# Altium schematic sheet wifi.SchDoc
size A
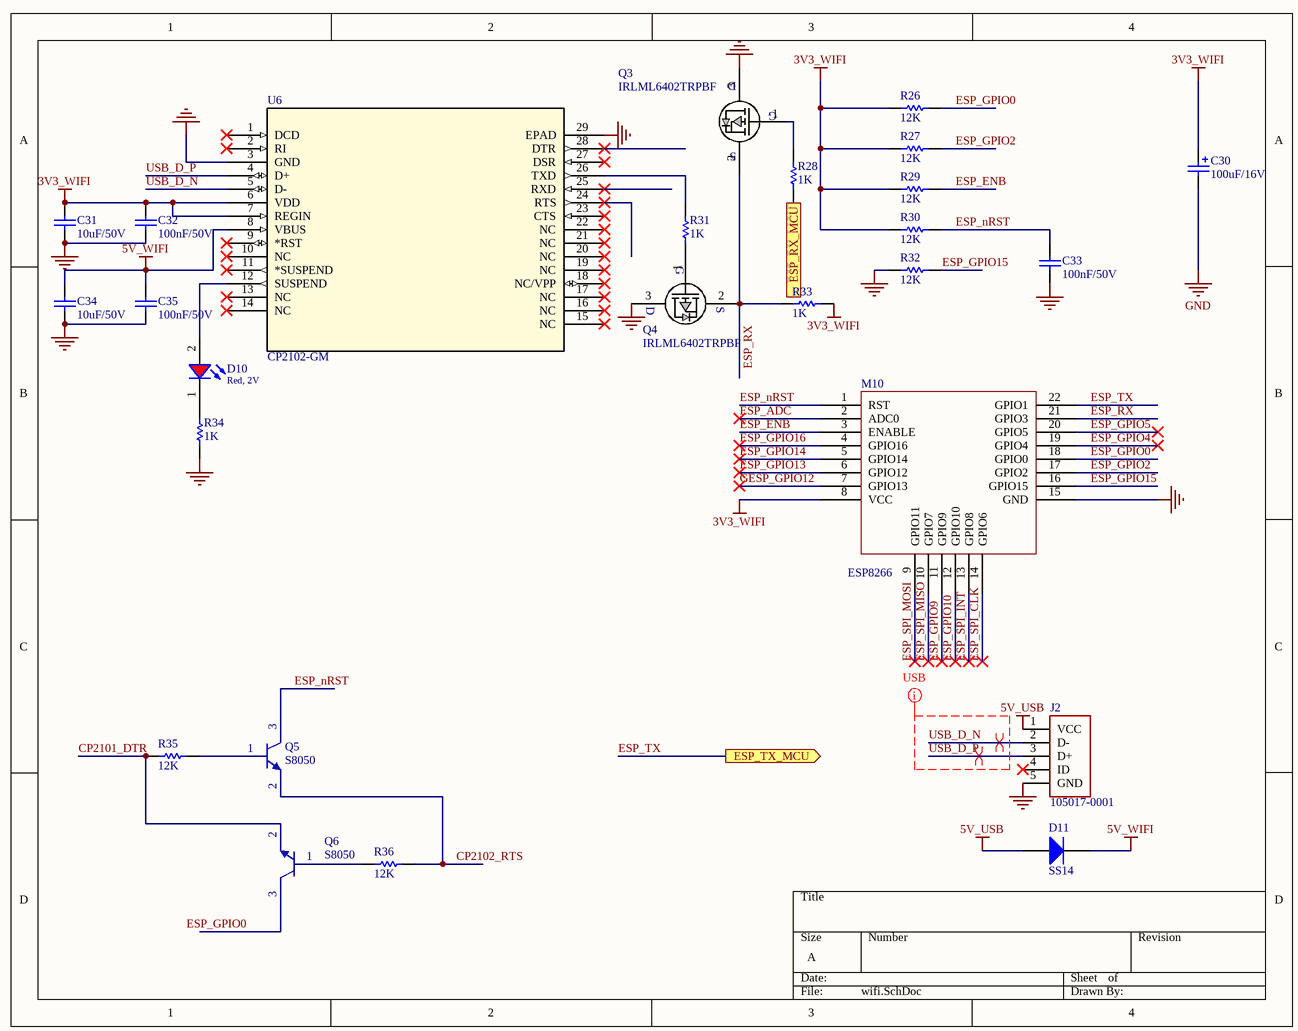
[diagram p0: wifi.SchDoc]

## Parts
C30  value 100uF/16V  [CAP_SM_TAN]  (hidden comment: TAJB107M006RNJ)
C31  value 10uF/50V  [CAP-SM-0805]  (hidden comment: Cap-10uF-50V-0805)
C32  value 100nF/50V  [CAP-SM-0805]  (hidden comment: Cap-100nF-50V-0805)
C33  value 100nF/50V  [CAP-SM-0805]  (hidden comment: Cap-100nF-50V-0805)
C34  value 10uF/50V  [CAP-SM-0805]  (hidden comment: Cap-10uF-50V-0805)
C35  value 100nF/50V  [CAP-SM-0805]  (hidden comment: Cap-100nF-50V-0805)
D10  Red, 2V  [WL-SMCW_0805]
D11  SS14  [SS14]
J2  105017-0001  [CONN_105017-0001]
M10  ESP8266  [ESP8266]
Q3  IRLML6402TRPBF  [SOT23_NEX]
Q4  IRLML6402TRPBF  [SOT23_NEX]
Q5  S8050  [SOT23_NEX]
Q6  S8050  [SOT23_NEX]
R26  value 12K  [RES-SM-0805]  (hidden comment: Res-12K-0805)
R27  value 12K  [RES-SM-0805]  (hidden comment: Res-12K-0805)
R28  value 1K  [RES-SM-0805]  (hidden comment: Res-1K-0805)
R29  value 12K  [RES-SM-0805]  (hidden comment: Res-12K-0805)
R30  value 12K  [RES-SM-0805]  (hidden comment: Res-12K-0805)
R31  value 1K  [RES-SM-0805]  (hidden comment: Res-1K-0805)
R32  value 12K  [RES-SM-0805]  (hidden comment: Res-12K-0805)
R33  value 1K  [RES-SM-0805]  (hidden comment: Res-1K-0805)
R34  value 1K  [RES-SM-0805]  (hidden comment: Res-1K-0805)
R35  value 12K  [RES-SM-0805]  (hidden comment: Res-12K-0805)
R36  value 12K  [RES-SM-0805]  (hidden comment: Res-12K-0805)
U6  CP2102-GM  [CP2102-GM]

## Ports
ESP_RX_MCU (in), ESP_TX_MCU (out)

## Nets
3V3_WIFI: C30.1 C31.2 C32.2 M10.8(VCC) R26.1 R27.1 R29.1 R30.1 R33.2 U6.6(VDD) U6.7(REGIN)
5V_USB: D11.2(A) J2.1(VCC)
5V_WIFI: C34.2 C35.1 D11.1(K) U6.8(VBUS)
GND: C30.2 C31.1 C32.1 C33.1 C34.1 C35.2 J2.5(GND) M10.15(GND) Q3.3(D) Q4.3(D) R32.1 R34.1 U6.3(GND) U6.29(EPAD)
CP2101_DTR: Q6.2(E) R35.1
CP2102_RTS: Q5.2(E) R36.2
ESP_ADC: M10.2(ADC0)
ESP_ENB: M10.3(ENABLE) R29.2
ESP_GPIO0: M10.18(GPIO0) R26.2
ESP_GPIO2: M10.17(GPIO2) R27.2
ESP_GPIO4: M10.19(GPIO4)
ESP_GPIO5: M10.20(GPIO5)
ESP_GPIO9: M10.11(GPIO9)
ESP_GPIO10: M10.12(GPIO10)
ESP_GPIO13: M10.6(GPIO12)
ESP_GPIO14: M10.5(GPIO14)
ESP_GPIO15: M10.16(GPIO15) R32.2
ESP_GPIO16: M10.4(GPIO16)
ESP_nRST: C33.2 M10.1(RST) Q5.3(C) R30.2
ESP_RX: M10.21(GPIO3) Q3.2(S) Q4.2(S) R33.1
ESP_RX_MCU: R28.1 ; port ESP_RX_MCU
ESP_SPI_CLK: M10.14(GPIO6)
ESP_SPI_INT: M10.13(GPIO8)
ESP_SPI_MISO: M10.10(GPIO7)
ESP_SPI_MOSI: M10.9(GPIO11)
ESP_TX: M10.22(GPIO1) ; port ESP_TX_MCU
GESP_GPIO12: M10.7(GPIO13)
USB_D_N: J2.2(D-) U6.5(D-)
USB_D_P: J2.3(D+) U6.4(D+)
NetD10_1: D10.1(K) R34.2
NetD10_2: D10.2(A) U6.12(SUSPEND)
NetQ3_1: Q3.1(G) R28.2
NetQ4_1: Q4.1(G) R31.1
NetQ5_1: Q5.1(B) R35.2
NetQ6_1: Q6.1(B) R36.1
NetR31_2: R31.2 U6.26(TXD)

Not connected (* = marked no-connect by the designer): J2 4(ID)*; Q6 3(C); U6 1(DCD)* 2(RI)* 9(*RST)* 10(NC)* 11(*SUSPEND)* 13(NC)* 14(NC)* 15(NC)* 16(NC)* 17(NC)* 18(NC/VPP)* 19(NC)* 20(NC)* 21(NC)* 22(NC)* 23(CTS)* 24(RTS)* 25(RXD)* 27(DSR)* 28(DTR)*

## Layout directives
differential pair: USB_D_N, USB_D_P
mark named USB: USB_D_N, USB_D_P

## Notes on the sheet
- Labels drawn without touching a wire or pin: ESP_GPIO0

## Library data of the parts
C30 = Cap-Tan-100uF-16V: Manufacturer: Nichicon; Manufacturer Part Number: UWX1C101MCL1GB; Local Supplier: icdayroi; Local Supplier Link: https://icdayroi.com/tu-tantalum-100uf-16v-smd6032; Supplier 1: Digikey; Supplier 1 Part Number: 493-2105-1-ND; Supplier 1 Link: https://www.digikey.com/product-detail/en/nichicon/UWX1C101MCL1GB/493-2105-1-ND/590080
C31 C34 = Cap-10uF-50V-0805: CAP CER 10UF 50V X5R 0805; Manufacturer: Yageo; Manufacturer Part Number: CC0805KKX5R9BB106; Local Supplier: thegioiic; Local Supplier Link: https://thegioiic.com/products/tu-10uf-50v-0805; Supplier 1: Digikey; Supplier 1 Link: https://www.digikey.com/product-detail/en/yageo/CC0805KKX5R9BB106/311-3499-2-ND/7164383; Supplier 1 Part Number: 311-3499-2-ND
C32 C33 C35 = Cap-100nF-50V-0805: CAP CER 0.1UF 50V Y5V 0805; Manufacturer: Samsung Electro-Mechanics; Manufacturer Part Number: CL21F104ZBCNNNC; Local Supplier: thegioiic; Local Supplier Link: https://thegioiic.com/products/tu-100nf-0-1uf-50v-0805; Supplier 1: Digikey; Supplier 1 Part Number: 1276-1007-1-ND; Supplier 1 Link: https://www.digikey.com/product-detail/en/samsung-electro-mechanics/CL21F104ZBCNNNC/1276-1007-1-ND/3889093
D10 = 150080RS75000: WL-SMCW SMT Mono-color Chip LED Waterclear, size 0805, Red, 2V, 140deg; Chip Technology: AlInGaP; Dominant Wavelength typ.: 625nm; Luminous Intensity typ.: 150mcd; Peak Wavelength typ.: 630nm; Viewing Angle: 140deg; ComponentLink1Description: Manufacturer; ComponentLink1URL: http://www.we-online.de; ComponentLink2URL: https://www.we-online.com/catalog/datasheet/150080RS75000.pdf; ComponentLink2Description: Datasheet; Forward Voltage typ.: 2V; Emitting Color: Red; Mounting Technology: SMT; Operating Temperature: -40 to +85degC; Published Date: December 2019; Part Number: 150080RS75000; Packaging: Tape and Reel; Size: 0805; Publisher: Wurth Elektronik
D11 = Diode-SS14: DIODE SCHOTTKY 40V 1A SMA; Manufacturer: ON Semiconductor; Local Supplier: thegioiic; Local Supplier Link: https://thegioiic.com/products/ss14-sma; Supplier 1: Digikey; Supplier 1 Link: https://www.digikey.com/product-detail/en/on-semiconductor/SS14/SS14CT-ND/965729; Manufacturer Part Number: SS14; Supplier 1 Part Number: SS14CT-ND
J2 = 105017-0001: No Description Available; Vendor: Molex Connector Corporation; Built_By: EMA_Cory; SourceLibrary: Molex_2020-05-26; Datasheet: https://www.molex.com/pdm_docs/sd/1050170001_sd.pdf; Manufacturer_Part_Number: 105017-0001; Copyright: Copyright (C) 2018 Accelerated Designs. All rights reserved; RefDes: RefDes; Type: DEV
Q3 Q4 = IRLML6402TRPBF: P-Channel 20V 3.7A (Ta) 1.3W (Ta) Surface Mount Micro3™/SOT-23
R26 R27 R29 R30 R32 R35 R36 = Res-12K-0805: RES 12 KOHM JUMPER 0805; Manufacturer: Vishay Thin Film; Manufacturer Part Number: PAT0805E3121BST1; Local Supplier: icdayroi; Local Supplier Link: https://icdayroi.com/dien-tro-12k-0805-1-goi-50-con; Supplier 1: Digikey; Supplier 1 Link: https://www.digikey.com/product-detail/en/vishay-thin-film/PAT0805E3121BST1/PAT0805E3121BST1-ND/2281536; Supplier 1 Part Number: PAT0805E3121BST1-ND
R28 R31 R33 R34 = Res-1K-0805: RES 1K OHM 1% 1/4W 0805; Manufacturer: Stackpole Electronics Inc; Manufacturer Part Number: RNCP0805FTD1K00; Local Supplier: thegioiic; Local Supplier Link: https://thegioiic.com/products/dien-tro-1k-ohm-0805-5; Supplier 1: Digikey; Supplier 1 Link: https://www.digikey.com/product-detail/en/stackpole-electronics-inc/RNCP0805FTD1K00/RNCP0805FTD1K00CT-ND/2240568; Supplier 1 Part Number: RNCP0805FTD1K00CT-ND
U6 = CP2102-GM: No Description Available; Vendor: Silicon Labs; Built_By: EMA_UL_Team; SourceLibrary: Silicon_Labs_2015-03-23; Manufacturer_Part_Number: CP2102-GM; Copyright: Copyright (C) 2018 Accelerated Designs. All rights reserved; RefDes: RefDes; Type: DEV